# EasyEDA Pro project coBWeb.epro, board PCB1
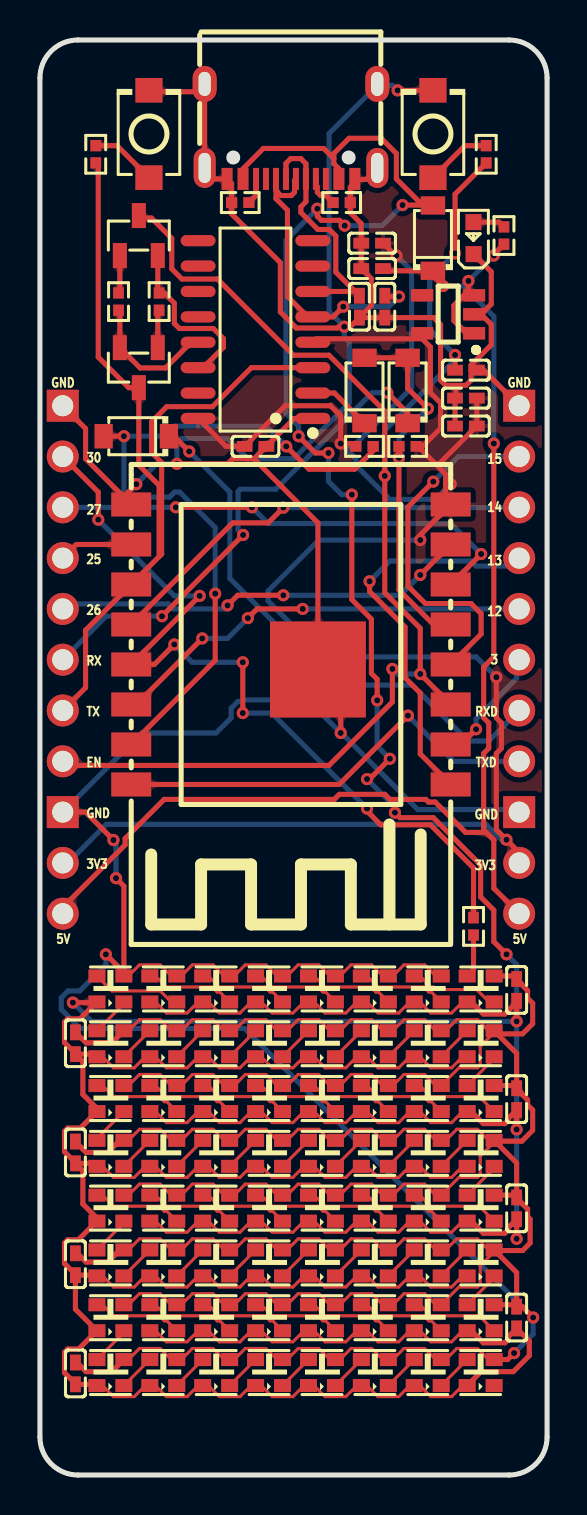
[diagram p2: board, top side]
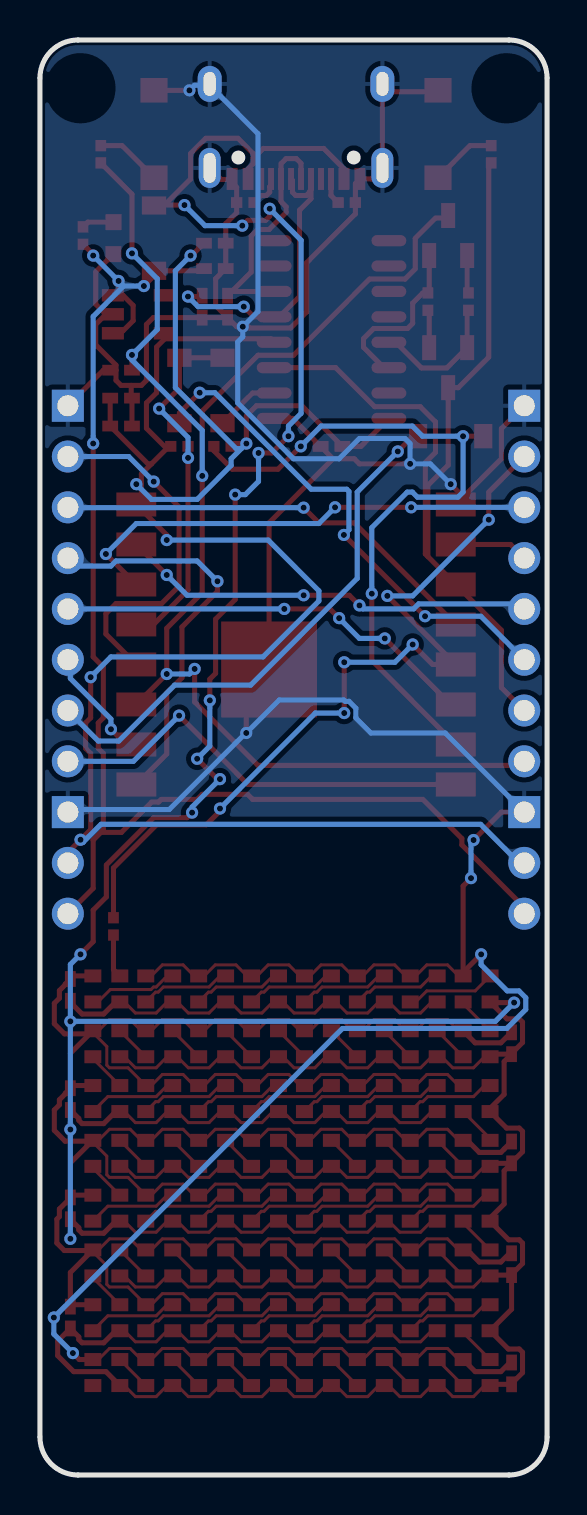
[diagram p3: board, bottom side, seen from below]

Outline 25.4 x 71.76 mm; copper layers: Top Layer, Bottom Layer. Coordinates in mm from the lower left corner of the outline.
Outline path: 0,69.85 0,1.91 arc(0.56,0.56) 1.91,0 23.5,0 arc(24.84,0.56) 25.4,1.91 25.4,69.85 arc(24.84,71.2) 23.5,71.76 1.91,71.76 arc(0.56,71.2) 0,69.85
Stack: Top Layer 0.035mm / Dielectric1 1.51mm FR4 er 4.5 / Bottom Layer 0.035mm

## Design rules (mm)
template: Custom Config
spacing copperThickness1oz (default): track to track 0.102, other pairs 0.152 to 0.3
spacing copperThickness2oz: track to track 0.203, other pairs 0.152 to 0.3
track width copperThickness1oz (default): min 0.127, default 0.254, max 2.54
track width copperThickness2oz: min 0.203, default 0.254, max 2.54
differential pair differentialPair (default): width min 0.127, default 0.254, max 2.54; gap min 0.152, default 0.152
via viaSize (default): diameter min 0.5, default 0.61, max 10; hole min 0.3, default 0.305, max 6.3

## Placement (name value [footprint] x y rotation side)
C1  100nF  [C0402]  16.64 60.33 180 top
C2  100nF  [C0402]  16.64 61.6 180 top
C3  100nF  [C0402]  17.27 58.42 270 top
C4  100nF  [C0402]  16 58.42 270 top
C5  100nF  [C0402]  21.34 52.45 180 top
C6  10uF  [C0402]  21.34 53.85 180 top
C7  100nF  [C0402]  10.79 51.44 180 top
C8  100nF  [C0402]  21.34 55.25 0 top
C9  100nF  [C0402]  23.88 24.26 270 top
C10  100nF  [C0402]  1.78 21.59 270 top
C11  100nF  [C0402]  1.78 5.08 270 top
C12  100nF  [C0402]  1.78 10.54 270 top
C13  100nF  [C0402]  23.88 7.87 270 top
C14  100nF  [C0402]  23.88 18.8 270 top
C15  100nF  [C0402]  1.78 16.13 270 top
C16  100nF  [C0402]  23.88 13.34 270 top
D1  1N5819HW-7-F  [SOD-123_L2.7-W1.6-LS3.7-RD]  19.69 61.85 90 top
D2  1N5819HW-7-F  [SOD-123_L2.7-W1.6-LS3.7-RD]  18.41 54.23 90 top
D3  1N5819HW-7-F  [SOD-123_L2.7-W1.6-LS3.7-RD]  16.26 54.23 90 top
D4  1N5819HW-7-F  [SOD-123_L2.7-W1.6-LS3.7-RD]  4.83 51.94 180 top
H1  HB-PH3-254111PB2GOP  [HDR-TH_11P-P2.54-V-M]  1.14 40.77 270 bottom
H2  HB-PH3-254111PB2GOP  [HDR-TH_11P-P2.54-V-M]  24 40.77 270 bottom
L1  2.4GHz  [WIFI-SMD_BW16]  12.57 41.53 180 top
LED1  XL-1608SURC-06  [LED0603-RD_RED]  21.72 61.85 90 top
LED2  XL-2020RGBC-WS2812B  [LED-SMD_4P-L2.0-W2.0-BR-1]  22.07 24.3 0 top
LED3  XL-2020RGBC-WS2812B  [LED-SMD_4P-L2.0-W2.0-BR-1]  19.42 24.3 0 top
LED4  XL-2020RGBC-WS2812B  [LED-SMD_4P-L2.0-W2.0-BR-1]  16.77 24.3 0 top
LED5  XL-2020RGBC-WS2812B  [LED-SMD_4P-L2.0-W2.0-BR-1]  14.13 24.3 0 top
LED6  XL-2020RGBC-WS2812B  [LED-SMD_4P-L2.0-W2.0-BR-1]  11.48 24.3 0 top
LED7  XL-2020RGBC-WS2812B  [LED-SMD_4P-L2.0-W2.0-BR-1]  8.83 24.3 0 top
LED8  XL-2020RGBC-WS2812B  [LED-SMD_4P-L2.0-W2.0-BR-1]  6.18 24.3 0 top
LED9  XL-2020RGBC-WS2812B  [LED-SMD_4P-L2.0-W2.0-BR-1]  3.53 24.3 0 top
LED10  XL-2020RGBC-WS2812B  [LED-SMD_4P-L2.0-W2.0-BR-1]  3.53 21.56 0 top
LED11  XL-2020RGBC-WS2812B  [LED-SMD_4P-L2.0-W2.0-BR-1]  6.18 21.56 0 top
LED12  XL-2020RGBC-WS2812B  [LED-SMD_4P-L2.0-W2.0-BR-1]  8.83 21.56 0 top
LED13  XL-2020RGBC-WS2812B  [LED-SMD_4P-L2.0-W2.0-BR-1]  11.48 21.56 0 top
LED14  XL-2020RGBC-WS2812B  [LED-SMD_4P-L2.0-W2.0-BR-1]  14.13 21.56 0 top
LED15  XL-2020RGBC-WS2812B  [LED-SMD_4P-L2.0-W2.0-BR-1]  16.77 21.56 0 top
LED16  XL-2020RGBC-WS2812B  [LED-SMD_4P-L2.0-W2.0-BR-1]  19.42 21.56 0 top
LED17  XL-2020RGBC-WS2812B  [LED-SMD_4P-L2.0-W2.0-BR-1]  22.07 21.56 0 top
LED18  XL-2020RGBC-WS2812B  [LED-SMD_4P-L2.0-W2.0-BR-1]  22.07 18.82 0 top
LED19  XL-2020RGBC-WS2812B  [LED-SMD_4P-L2.0-W2.0-BR-1]  19.42 18.82 0 top
LED20  XL-2020RGBC-WS2812B  [LED-SMD_4P-L2.0-W2.0-BR-1]  16.77 18.82 0 top
LED21  XL-2020RGBC-WS2812B  [LED-SMD_4P-L2.0-W2.0-BR-1]  14.13 18.82 0 top
LED22  XL-2020RGBC-WS2812B  [LED-SMD_4P-L2.0-W2.0-BR-1]  11.48 18.82 0 top
LED23  XL-2020RGBC-WS2812B  [LED-SMD_4P-L2.0-W2.0-BR-1]  8.83 18.82 0 top
LED24  XL-2020RGBC-WS2812B  [LED-SMD_4P-L2.0-W2.0-BR-1]  6.18 18.82 0 top
LED25  XL-2020RGBC-WS2812B  [LED-SMD_4P-L2.0-W2.0-BR-1]  3.53 18.82 0 top
LED26  XL-2020RGBC-WS2812B  [LED-SMD_4P-L2.0-W2.0-BR-1]  3.53 16.08 0 top
LED27  XL-2020RGBC-WS2812B  [LED-SMD_4P-L2.0-W2.0-BR-1]  6.18 16.08 0 top
LED28  XL-2020RGBC-WS2812B  [LED-SMD_4P-L2.0-W2.0-BR-1]  8.83 16.08 0 top
LED29  XL-2020RGBC-WS2812B  [LED-SMD_4P-L2.0-W2.0-BR-1]  11.48 16.08 0 top
LED30  XL-2020RGBC-WS2812B  [LED-SMD_4P-L2.0-W2.0-BR-1]  14.13 16.08 0 top
LED31  XL-2020RGBC-WS2812B  [LED-SMD_4P-L2.0-W2.0-BR-1]  16.77 16.08 0 top
LED32  XL-2020RGBC-WS2812B  [LED-SMD_4P-L2.0-W2.0-BR-1]  19.42 16.08 0 top
LED33  XL-2020RGBC-WS2812B  [LED-SMD_4P-L2.0-W2.0-BR-1]  22.07 16.08 0 top
LED34  XL-2020RGBC-WS2812B  [LED-SMD_4P-L2.0-W2.0-BR-1]  22.07 13.34 0 top
LED35  XL-2020RGBC-WS2812B  [LED-SMD_4P-L2.0-W2.0-BR-1]  19.42 13.34 0 top
LED36  XL-2020RGBC-WS2812B  [LED-SMD_4P-L2.0-W2.0-BR-1]  16.77 13.34 0 top
LED37  XL-2020RGBC-WS2812B  [LED-SMD_4P-L2.0-W2.0-BR-1]  14.13 13.34 0 top
LED38  XL-2020RGBC-WS2812B  [LED-SMD_4P-L2.0-W2.0-BR-1]  11.48 13.34 0 top
LED39  XL-2020RGBC-WS2812B  [LED-SMD_4P-L2.0-W2.0-BR-1]  8.83 13.34 0 top
LED40  XL-2020RGBC-WS2812B  [LED-SMD_4P-L2.0-W2.0-BR-1]  6.18 13.34 0 top
LED41  XL-2020RGBC-WS2812B  [LED-SMD_4P-L2.0-W2.0-BR-1]  3.53 13.34 0 top
LED42  XL-2020RGBC-WS2812B  [LED-SMD_4P-L2.0-W2.0-BR-1]  3.53 10.6 0 top
LED43  XL-2020RGBC-WS2812B  [LED-SMD_4P-L2.0-W2.0-BR-1]  6.18 10.6 0 top
LED44  XL-2020RGBC-WS2812B  [LED-SMD_4P-L2.0-W2.0-BR-1]  8.83 10.6 0 top
LED45  XL-2020RGBC-WS2812B  [LED-SMD_4P-L2.0-W2.0-BR-1]  11.48 10.6 0 top
LED46  XL-2020RGBC-WS2812B  [LED-SMD_4P-L2.0-W2.0-BR-1]  14.13 10.6 0 top
LED47  XL-2020RGBC-WS2812B  [LED-SMD_4P-L2.0-W2.0-BR-1]  16.77 10.6 0 top
LED48  XL-2020RGBC-WS2812B  [LED-SMD_4P-L2.0-W2.0-BR-1]  19.42 10.6 0 top
LED49  XL-2020RGBC-WS2812B  [LED-SMD_4P-L2.0-W2.0-BR-1]  22.07 10.6 0 top
LED50  XL-2020RGBC-WS2812B  [LED-SMD_4P-L2.0-W2.0-BR-1]  22.07 7.86 0 top
LED51  XL-2020RGBC-WS2812B  [LED-SMD_4P-L2.0-W2.0-BR-1]  19.42 7.86 0 top
LED52  XL-2020RGBC-WS2812B  [LED-SMD_4P-L2.0-W2.0-BR-1]  16.77 7.86 0 top
LED53  XL-2020RGBC-WS2812B  [LED-SMD_4P-L2.0-W2.0-BR-1]  14.13 7.86 0 top
LED54  XL-2020RGBC-WS2812B  [LED-SMD_4P-L2.0-W2.0-BR-1]  11.48 7.86 0 top
LED55  XL-2020RGBC-WS2812B  [LED-SMD_4P-L2.0-W2.0-BR-1]  8.83 7.86 0 top
LED56  XL-2020RGBC-WS2812B  [LED-SMD_4P-L2.0-W2.0-BR-1]  6.18 7.86 0 top
LED57  XL-2020RGBC-WS2812B  [LED-SMD_4P-L2.0-W2.0-BR-1]  3.53 7.86 0 top
LED58  XL-2020RGBC-WS2812B  [LED-SMD_4P-L2.0-W2.0-BR-1]  3.53 5.12 0 top
LED59  XL-2020RGBC-WS2812B  [LED-SMD_4P-L2.0-W2.0-BR-1]  6.18 5.12 0 top
LED60  XL-2020RGBC-WS2812B  [LED-SMD_4P-L2.0-W2.0-BR-1]  8.83 5.12 0 top
LED61  XL-2020RGBC-WS2812B  [LED-SMD_4P-L2.0-W2.0-BR-1]  11.48 5.12 0 top
LED62  XL-2020RGBC-WS2812B  [LED-SMD_4P-L2.0-W2.0-BR-1]  14.13 5.12 0 top
LED63  XL-2020RGBC-WS2812B  [LED-SMD_4P-L2.0-W2.0-BR-1]  16.77 5.12 0 top
LED64  XL-2020RGBC-WS2812B  [LED-SMD_4P-L2.0-W2.0-BR-1]  19.42 5.12 0 top
LED65  XL-2020RGBC-WS2812B  [LED-SMD_4P-L2.0-W2.0-BR-1]  22.07 5.12 0 top
Q1  S8050  [SOT-23-3_L2.9-W1.3-P1.90-LS2.4-BR]  4.95 55.37 90 top
Q2  S8050  [SOT-23-3_L2.9-W1.3-P1.90-LS2.4-BR]  4.95 61.98 270 top
R1  5.1kΩ  [R0402]  15.11 63.63 180 top
R2  5.1kΩ  [R0402]  10.03 63.63 0 top
R3  470Ω  [R0402]  23.24 61.98 90 top
R4  10kΩ  [R0402]  18.41 51.44 0 top
R5  10kΩ  [R0402]  16.26 51.44 0 top
R6  12kΩ  [R0402]  5.97 58.67 270 top
R7  12kΩ  [R0402]  3.94 58.67 90 top
R8  22Ω  [R0402]  22.35 66.04 90 top
R9  1kΩ  [R0402]  2.79 66.04 90 top
R10  470Ω  [R0402]  21.72 27.43 90 top
SW1  TS-1088-AR02016  [SW-SMD_L3.9-W3.0-P4.45]  19.69 67.06 90 top
SW2  TS-1088-AR02016  [SW-SMD_L3.9-W3.0-P4.45]  5.46 67.06 90 top
U1  AP2112K-3.3TRG1  [SOT-25-5_L2.9-W1.6-P0.95-LS2.8-BL]  20.45 58.04 90 top
U2  CH340C  [SOP-16_L10.0-W3.9-P1.27-LS6.0-BL]  10.79 57.28 90 top
USB1  TYPE-C 16PIN 2MD(073)  [USB-C-SMD_TYPE-C-6PIN-2MD-073]  12.57 67.18 180 top

## Footprints (pads in the part's own frame, mm; a bottom-side part is the same pattern mirrored in y, then rotated)
C0402
  rect 0.79x0.54 smd: 1(-0.545,0) 2(0.545,0)
HDR-TH_11P-P2.54-V-M
  rect 1.6x1.6 hole 1.05: 1(-12.7,0) 9(7.62,0)
  round 1.6 hole 1.05: 2(-10.16,0) 3(-7.62,0) 4(-5.08,0) 5(-2.54,0) 6(0,0) 7(2.54,0) 8(5.08,0) 10(10.16,0) 11(12.7,0)
LED0603-RD_RED
  rect 0.8x0.8 smd: 1(-0.799,-0.004) 2(0.799,0.004)
LED-SMD_4P-L2.0-W2.0-BR-1
  rect 0.85x0.65 smd: 1(0.675,-0.65) 2(0.675,0.65) 3(-0.675,0.65) 4(-0.675,-0.65)
R0402
  rect 0.566x0.54 smd: 1(-0.433,0) 2(0.433,0)
SOD-123_L2.7-W1.6-LS3.7-RD
  rect 0.91x1.22 smd: 1(-1.635,0) 2(1.635,0)
SOP-16_L10.0-W3.9-P1.27-LS6.0-BL
  oval 0.56x1.745 smd: 1(-4.445,-2.873) 2(-3.175,-2.873) 3(-1.905,-2.873) 4(-0.635,-2.873) 5(0.635,-2.873) 6(1.905,-2.873) 7(3.175,-2.873) 8(4.445,-2.873) 9(4.445,2.873) 10(3.175,2.873) 11(1.905,2.873) 12(0.635,2.873) 13(-0.635,2.873) 14(-1.905,2.873) 15(-3.175,2.873) 16(-4.445,2.873)
SOT-23-3_L2.9-W1.3-P1.90-LS2.4-BR
  rect 1.25x0.7 smd: 1(1,-0.95) 2(1,0.95) 3(-1,0)
SOT-25-5_L2.9-W1.6-P0.95-LS2.8-BL
  rect 0.623x1.105 smd: 1(-0.95,-1.3) 2(-0.001,-1.3) 3(0.95,-1.3) 4(0.95,1.3) 5(-0.95,1.3)
SW-SMD_L3.9-W3.0-P4.45
  rect 1.23x1.36 smd: 1(-2.185,0) 2(2.185,0)
USB-C-SMD_TYPE-C-6PIN-2MD-073
  rect 0.55x1.1 smd: 1(-3.2,2.375) 2(-2.4,2.375) 11(2.4,2.375) 12(3.2,2.375)
  rect 0.3x1.1 smd: 3(-1.75,2.375) 4(-1.25,2.375) 5(-0.75,2.375) 6(-0.25,2.375) 7(0.25,2.375) 8(0.75,2.375) 9(1.25,2.375) 10(1.75,2.375)
  oval 1.1x2 hole 0.6x1.5: 13(-4.325,1.825) 14(4.325,1.825)
  oval 1.2x1.8 hole 0.6x1.2: 13(-4.325,-2.375) 14(4.325,-2.375)
WIFI-SMD_BW16
  rect 2x1.2 smd: 1(-8,7) 2(-8,5) 3(-8,3) 4(-8,1) 5(-8,-1) 6(-8,-3) 7(-8,-5) 8(-8,-7) 9(8,-7) 10(8,-5) 11(8,-3) 12(8,-1) 13(8,1) 14(8,3) 15(8,5) 16(8,7)
  rect 4.8x4.8 smd: 17(-1.35,1.25)

## Nets
As in the schematic.

Pads without a net: LED65 1; U1 4; U2 7 8 9 10 11 12 15; USB1 3 9

## Via types
v1: diameter 0.61, hole 0.305, Top Layer to Bottom Layer, 71 vias

## Routing (per net, layer and track width the routed paths; a pad name or vN(x,y) marks a point on that pad's centre or on a via; arc(x,y) is an arc through that point)
3V3: length 108.9
  Top Layer w0.254: 19.05,51.32 20.06,52.34 20.06,53.61 19.56,54.12 19.56,56.4 19.15,56.81 ; 19.05,51.32 19.81,50.56 ; 19.05,51.32 18.94,51.44 R4.2 ; C2.1 17.8,60.98 v1(17.85,60.98) ; v1(19.05,46.75) 19.05,47.01 L1.8 20.32,48.78 20.32,49.55 ; 19.81,50.56 19.99,50.56 C5.1 C6.1 ; 19.81,50.56 20.32,50.05 20.32,49.55 ; 19.15,56.81 U1.5 ; 19.15,56.81 13.84,56.81 U2.4 ; R5.1 15.68,51.58 v1(15.06,51.58) 15.06,52.96 14.55,53.47 12.28,53.47 C7.2 9.32,51.44 7.92,52.83 ; 20.32,49.55 v1(20.57,49.55) ; v1(22.86,39.89) 22.86,37.86 23.11,37.61 23.11,36.34 22.86,36.08 22.86,32.27 v1(23.37,31.77) 24,31.13 H2.10
  Bottom Layer w0.254: v1(17.85,60.98) 18.62,60.21 18.62,54.37 15.57,51.32 15.31,51.32 ; 15.31,51.32 v1(15.06,51.58) ; 15.31,51.32 15.82,50.82 15.82,50.49 17.52,48.78 19.81,48.78 v1(20.57,49.55) ; v1(22.86,39.89) 21.84,40.91 14.22,40.91 11.43,43.7 11.43,44.21 13.97,46.75 v1(19.05,46.75) ; 23.37,31.64 23.24,31.64 22.34,32.54 3.33,32.54 1.27,30.48 1.14,30.48
5V: length 70.1
  Top Layer w0.254: v1(21.46,59.71) 21.46,59.27 U1.3 21.24,58.99 20.73,58.48 20.73,57.72 21.24,57.21 21.63,57.21 U1.1 ; R3.1 22.73,61.04 v1(22.73,60.98) ; 22.73,31.75 22.73,29.34 H2.11 ; 22.73,31.75 22.73,31.77 22.22,32.27 22.22,36.08 22.48,36.34 22.48,37.61 22.22,37.86 22.22,40.4 22.73,40.91 v1(22.73,51.58) ; 22.73,31.75 22.35,32.13 21.32,32.13 19.8,33.65 19.46,33.65 19.33,33.78 17.53,33.78 17.27,34.04 15,34.04 14.74,33.78 6.22,33.78 4.27,31.83 4.27,31.51 1.14,28.38 H1.11 ; v1(20.19,59.45) 19.69,59.96 D1.1 17.29,60.21 C1.1
  Bottom Layer w0.254: 21.21,59.45 22.73,57.93 v1(22.73,51.58) ; 21.21,59.45 v1(20.19,59.45) ; 21.21,59.45 v1(21.46,59.71) v1(22.73,60.98)
GND: length 408.3
  Top Layer w0.152: LED42.2 4.43,11.25 4.98,11.81 6.02,11.81 6.58,11.25 LED43.2 7.08,11.25 7.63,11.81 8.67,11.81 9.23,11.25 LED44.2 9.73,11.25 10.28,11.81 11.32,11.81 11.87,11.25 LED45.2 12.38,11.25 12.93,11.81 13.97,11.81 14.52,11.25 LED46.2 15.03,11.25 15.58,11.81 16.62,11.81 17.17,11.25 LED47.2 17.68,11.25 18.23,11.81 19.27,11.81 19.82,11.25 LED48.2 20.32,11.25 20.88,11.81 21.92,11.81 22.47,11.25 LED49.2 22.75,11.16 22.05,10.47 22.05,9.53 21.92,9.4 20.99,9.4 LED51.2 19.82,8.51 19.27,9.07 18.23,9.07 17.68,8.51 LED52.2 17.17,8.51 16.62,9.07 15.58,9.07 15.03,8.51 LED53.2 14.52,8.51 13.97,9.07 12.93,9.07 12.38,8.51 LED54.2 11.87,8.51 11.32,9.07 10.28,9.07 9.73,8.51 LED55.2 9.23,8.51 8.67,9.07 7.63,9.07 7.08,8.51 LED56.2 6.58,8.51 6.02,9.07 4.98,9.07 4.43,8.51 LED57.2 ; LED3.2 19.82,24.95 19.27,25.51 18.23,25.51 17.68,24.95 LED4.2 17.17,24.95 16.62,25.51 15.58,25.51 15.03,24.95 LED5.2 14.52,24.95 13.97,25.51 12.93,25.51 12.38,24.95 LED6.2 11.87,24.95 11.32,25.51 10.28,25.51 9.73,24.95 LED7.2 9.23,24.95 8.67,25.51 7.63,25.51 7.08,24.95 LED8.2 6.58,24.95 6.02,25.51 4.98,25.51 4.43,24.95 LED9.2 ; LED58.2 4.43,5.77 4.98,6.33 6.02,6.33 6.58,5.77 LED59.2 7.08,5.77 7.63,6.33 8.67,6.33 9.23,5.77 LED60.2 9.73,5.77 10.28,6.33 11.32,6.33 11.87,5.77 LED61.2 12.38,5.77 12.93,6.33 13.97,6.33 14.52,5.77 LED62.2 15.03,5.77 15.58,6.33 16.62,6.33 17.17,5.77 LED63.2 17.68,5.77 18.23,6.33 19.27,6.33 19.82,5.77 LED64.2 20.32,5.77 20.88,6.33 21.92,6.33 22.47,5.77 LED65.2 ; LED41.2 4.43,13.99 4.98,14.55 6.02,14.55 6.58,13.99 LED40.2 7.08,13.99 7.63,14.55 8.67,14.55 9.23,13.99 LED39.2 9.73,13.99 10.28,14.55 11.32,14.55 11.87,13.99 LED38.2 12.38,13.99 12.93,14.55 13.97,14.55 14.52,13.99 LED37.2 15.03,13.99 15.58,14.55 16.62,14.55 17.17,13.99 LED36.2 17.68,13.99 18.23,14.55 19.27,14.55 19.82,13.99 LED35.2 20.99,14.88 21.92,14.88 22.05,15.01 22.05,15.95 22.75,16.64 LED33.2 22.47,16.73 21.92,17.29 20.88,17.29 20.32,16.73 LED32.2 19.82,16.73 19.27,17.29 18.23,17.29 17.68,16.73 LED31.2 17.17,16.73 16.62,17.29 15.58,17.29 15.03,16.73 LED30.2 14.52,16.73 13.97,17.29 12.93,17.29 12.38,16.73 LED29.2 11.87,16.73 11.32,17.29 10.28,17.29 9.73,16.73 LED28.2 9.23,16.73 8.67,17.29 7.63,17.29 7.08,16.73 LED27.2 6.58,16.73 6.02,17.29 4.98,17.29 4.43,16.73 LED26.2 ; LED10.2 4.43,22.21 4.98,22.77 6.02,22.77 6.58,22.21 LED11.2 7.08,22.21 7.63,22.77 8.67,22.77 9.23,22.21 LED12.2 9.73,22.21 10.28,22.77 11.32,22.77 11.87,22.21 LED13.2 12.38,22.21 12.93,22.77 13.97,22.77 14.52,22.21 LED14.2 15.03,22.21 15.58,22.77 16.62,22.77 17.17,22.21 LED15.2 17.68,22.21 18.23,22.77 19.27,22.77 19.82,22.21 LED16.2 20.32,22.21 20.88,22.77 21.92,22.77 22.47,22.21 LED17.2 22.75,22.12 22.05,21.43 22.05,20.49 21.92,20.36 20.99,20.36 20.1,19.47 19.82,19.47 19.27,20.03 18.23,20.03 17.68,19.47 17.17,19.47 16.62,20.03 15.58,20.03 15.03,19.47 14.52,19.47 13.97,20.03 12.93,20.03 12.38,19.47 11.87,19.47 11.32,20.03 10.28,20.03 9.73,19.47 9.23,19.47 8.67,20.03 7.63,20.03 7.08,19.47 6.58,19.47 6.02,20.03 4.98,20.03 4.43,19.47 4.2,19.47
  Top Layer w0.254: 20.83,54.48 20.32,54.48 20.07,54.74 20.07,57.53 19.72,57.88 C3.2 C4.2 ; 20.83,54.48 20.83,53.89 C6.2 C5.2 ; 20.83,54.48 21.34,54.48 21.59,54.74 21.59,55.24 ; C16.1 23.76,13.99 LED34.2 ; C16.1 23.88,15.61 LED33.2 ; C16.1 24,13.75 24,13.72 24.42,13.3 24.42,12.92 24.55,12.79 24.55,11.6 24.18,11.23 22.78,11.23 ; 8.25,69.17 5.53,69.17 SW2.2 ; 8.25,69.17 USB1.14 8.8,64.81 USB1.12 9.6,64.58 R2.1 9.6,63.06 12.04,60.62 12.04,58.16 12.84,57.35 14.9,57.35 14.97,57.42 v1(15.24,57.42) 15.55,57.42 C4.2 ; 8.25,69.17 USB1.14 ; 22.9,22.06 24.17,22.06 24.68,22.57 24.68,23.59 24.42,23.84 24.42,24.22 24.13,24.52 24.13,24.55 C9.1 23.72,24.95 LED2.2 ; 22.9,22.06 23.88,21.09 C14.1 ; 22.9,22.06 LED17.2 ; H1.1 2.29,52.32 2.29,50.82 4.32,48.78 ; 21.59,55.24 C8.2 22.22,55.25 H2.1 ; 21.59,55.24 21.59,55.5 22.61,56.51 22.61,57.53 22.1,58.04 ; LED26.2 4.14,16.67 3.94,16.67 3.39,16.13 2.31,16.13 2.15,16.29 2.15,16.3 C15.1 ; LED50.2 23.78,8.51 C13.1 ; 22.75,19.47 23.74,19.47 C14.1 ; C14.1 24.13,19.09 24.13,19.06 24.42,18.76 24.42,18.51 24.68,18.25 24.68,17.23 24.14,16.69 22.79,16.69 ; 4.2,25.13 LED9.2 ; 4.2,25.13 4.2,29.45 v1(3.81,29.85) ; 4.2,25.13 v1(3.3,26.04) ; LED58.2 3.6,5.17 2.31,5.17 1.86,5.62 C11.1 ; 10.72,50.82 13.92,47.61 L1.17 15.07,39.14 v1(15.07,37.1) ; 10.72,50.82 9.65,50.82 9.4,50.56 v1(6.86,50.56) ; 10.72,50.82 12.74,52.83 13.67,52.83 ; v1(24.7,7.87) 24.16,8.42 C13.1 ; 22.1,58.04 U1.2 ; 22.1,58.04 22.61,58.55 22.61,60.16 LED1.1 ; C4.2 16.6,58.47 16.6,59.82 C1.2 C2.2 16.09,62.57 15.55,63.12 15.55,64.39 15.8,64.64 15.8,64.78 ; 22.78,11.23 LED49.2 ; 22.78,11.23 23.88,10.12 C13.1 ; LED10.2 3.6,21.61 2.31,21.61 1.79,22.14 C10.1 ; v1(3.68,31.75) 2.29,33.15 H1.9 ; LED65.2 23.43,5.77 v1(23.75,6.1) ; L1.9 4.32,48.78 ; 4.32,48.78 4.32,49.04 v1(4.83,49.55) ; 15.8,64.78 USB1.1 ; 15.8,64.78 16.32,64.78 USB1.13 ; v1(17.91,69.24) 19.68,69.24 ; LED42.2 4.04,11.09 3.83,11.09 3.39,10.65 2.31,10.65 1.88,11.09 C12.1
  Bottom Layer w0.254: H2.9 23.88,33.27 18.92,33.27 15.09,37.1 v1(15.07,37.1) 13.41,38.76 10.19,38.76 10.11,38.68 9.92,38.68 9.58,38.34 9.58,37.86 8.82,37.1 5.1,37.1 H1.9 ; v1(3.3,26.04) 3.3,25.51 1.99,24.21 1.41,24.21 1.07,23.86 1.07,23.28 2.02,22.33 10.25,22.33 v1(24.7,7.87) 24.7,7.05 v1(23.75,6.1) ; v1(4.83,49.55) 5.84,50.56 v1(6.86,50.56) 6.86,51.58 7.11,51.83 9.4,51.83 10.41,50.82 12.7,50.82 15.5,53.61 15.5,56.66 15.24,56.91 v1(15.24,57.42) 14.48,58.18 14.48,67.07 16.9,69.49 ; 16.9,69.49 USB1.13 ; 16.9,69.49 17.66,69.49 v1(17.91,69.24) ; v1(3.81,29.85) 3.81,31.62 v1(3.68,31.75)
VBUS: length 316.7
  Top Layer w0.152: 21.4,20.91 21.17,20.91 20.62,20.36 19.58,20.36 19.03,20.91 18.52,20.91 17.97,20.36 16.93,20.36 16.38,20.91 15.87,20.91 15.32,20.36 14.28,20.36 13.73,20.91 13.22,20.91 12.67,20.36 11.63,20.36 11.08,20.91 10.58,20.91 10.02,20.36 8.98,20.36 8.43,20.91 7.93,20.91 7.37,20.36 6.33,20.36 5.78,20.91 5.28,20.91 4.72,20.36 3.69,20.36 3.13,20.91 2.85,20.91 ; LED40.4 5.78,12.69 6.33,12.14 7.37,12.14 7.93,12.69 LED39.4 8.43,12.69 8.98,12.14 10.02,12.14 10.58,12.69 LED38.4 11.08,12.69 11.63,12.14 12.67,12.14 13.22,12.69 LED37.4 13.73,12.69 14.28,12.14 15.32,12.14 15.87,12.69 LED36.4 16.38,12.69 16.93,12.14 17.97,12.14 18.52,12.69 LED35.4 19.03,12.69 19.58,12.14 20.62,12.14 21.17,12.69 LED34.4 ; 21.4,18.17 21.17,18.17 20.62,17.62 19.58,17.62 19.03,18.17 18.52,18.17 17.97,17.62 16.93,17.62 16.38,18.17 15.87,18.17 15.32,17.62 14.28,17.62 13.73,18.17 13.22,18.17 12.67,17.62 11.63,17.62 11.08,18.17 10.58,18.17 10.02,17.62 8.98,17.62 8.43,18.17 7.93,18.17 7.37,17.62 6.33,17.62 5.78,18.17 5.5,18.17 ; LED26.4 3.13,15.43 3.69,14.88 4.72,14.88 5.28,15.43 LED27.4 5.78,15.43 6.33,14.88 7.37,14.88 7.93,15.43 LED28.4 8.43,15.43 8.98,14.88 10.02,14.88 10.58,15.43 LED29.4 11.08,15.43 11.63,14.88 12.67,14.88 13.22,15.43 LED30.4 13.73,15.43 14.28,14.88 15.32,14.88 15.87,15.43 LED31.4 16.38,15.43 16.93,14.88 17.97,14.88 18.52,15.43 LED32.4 19.03,15.43 19.58,14.88 20.62,14.88 21.17,15.43 LED33.4 ; LED58.4 3.13,4.47 3.69,3.92 4.72,3.92 5.28,4.47 LED59.4 5.78,4.47 6.33,3.92 7.37,3.92 7.93,4.47 LED60.4 8.43,4.47 8.98,3.92 10.02,3.92 10.58,4.47 LED61.4 11.08,4.47 11.63,3.92 12.67,3.92 13.22,4.47 LED62.4 13.73,4.47 14.28,3.92 15.32,3.92 15.87,4.47 LED63.4 16.38,4.47 16.93,3.92 17.97,3.92 18.52,4.47 LED64.4 19.03,4.47 19.58,3.92 20.62,3.92 21.17,4.47 LED65.4 ; LED50.4 21.17,7.21 20.62,6.66 19.58,6.66 19.03,7.21 LED51.4 18.52,7.21 17.97,6.66 16.93,6.66 16.38,7.21 LED52.4 15.87,7.21 15.32,6.66 14.28,6.66 13.73,7.21 LED53.4 13.22,7.21 12.67,6.66 11.63,6.66 11.08,7.21 LED54.4 10.58,7.21 10.02,6.66 8.98,6.66 8.43,7.21 LED55.4 7.93,7.21 7.37,6.66 6.33,6.66 5.78,7.21 LED56.4 ; LED42.4 3.13,9.95 3.69,9.4 4.72,9.4 5.28,9.95 LED43.4 5.78,9.95 6.33,9.4 7.37,9.4 7.93,9.95 LED44.4 8.43,9.95 8.98,9.4 10.02,9.4 10.58,9.95 LED45.4 11.08,9.95 11.63,9.4 12.67,9.4 13.22,9.95 LED46.4 13.73,9.95 14.28,9.4 15.32,9.4 15.87,9.95 LED47.4 16.38,9.95 16.93,9.4 17.97,9.4 18.52,9.95 LED48.4 19.03,9.95 19.58,9.4 20.62,9.4 21.17,9.95 LED49.4 ; LED8.4 5.78,23.65 6.33,23.1 7.37,23.1 7.93,23.65 LED7.4 8.43,23.65 8.98,23.1 10.02,23.1 10.58,23.65 LED6.4 11.08,23.65 11.63,23.1 12.67,23.1 13.22,23.65 LED5.4 13.73,23.65 14.28,23.1 15.32,23.1 15.87,23.65 LED4.4 16.38,23.65 16.93,23.1 17.97,23.1 18.52,23.65 LED3.4 19.03,23.65 19.58,23.1 20.62,23.1 21.17,23.65 LED2.4
  Top Layer w0.254: C15.2 2.7,15.58 LED26.4 ; C15.2 2.15,15.21 2.15,13.55 2.85,12.85 LED41.4 1.92,11.76 1.39,11.76 1.23,11.6 1.23,10.58 1.78,10.03 1.78,10 ; C15.2 1.78,15.61 1.23,16.16 1.23,17.18 1.39,17.35 2.03,17.35 2.85,18.17 2.85,18.33 2.15,19.03 2.15,20.67 C10.2 ; v1(17.78,33.12) 18.03,32.87 19.71,32.87 22.07,30.5 22.07,28.9 22.73,28.24 22.73,26.67 v1(23.37,26.04) ; 14.72,65.82 14.21,66.33 11.19,66.33 10.17,65.32 USB1.11 ; 14.72,65.82 14.72,66.08 15.48,66.84 17.09,66.84 17.85,66.08 17.85,64.81 19.16,63.5 ; 14.72,65.82 14.72,65.57 14.97,65.32 USB1.2 ; v1(23.88,17.28) C14.2 23.45,17.83 23.45,17.73 23.29,17.57 22.21,17.57 21.6,18.17 21.4,18.17 ; 1.78,10 1.78,8.29 LED57.4 1.94,6.3 1.39,6.3 1.23,6.14 1.23,5.11 1.78,4.57 C11.2 2.79,4.54 LED58.4 ; 1.78,10 2.81,10 LED42.4 ; LED65.4 22.09,5.17 23.71,5.17 24.51,5.97 24.51,6.69 C13.2 23.45,6.9 23.45,6.77 23.29,6.61 22.21,6.61 21.6,7.21 LED50.4 ; LED2.4 21.6,23.65 22.21,23.05 23.29,23.05 23.88,23.64 ; 2.85,20.91 2.72,21.05 C10.2 ; 2.82,23.62 LED9.4 ; 2.82,23.62 v1(1.65,23.62) ; 2.82,23.62 2.01,22.81 1.39,22.81 1.23,22.65 1.23,21.62 1.78,21.08 C10.2 ; v1(16.38,34.8) 16.51,34.8 v1(17.53,35.81) ; C9.2 v1(23.88,22.68) ; v1(23.88,11.81) C16.2 23.45,12.37 23.45,12.25 23.29,12.09 22.21,12.09 21.6,12.69 LED34.4 ; v1(13.89,63.32) 13.89,62.94 14.1,62.74 15,62.74 v1(15.26,62.47) ; v1(14.45,51.11) 13.79,51.11 v1(12.95,51.94) ; 19.16,63.5 19.18,63.48 19.69,63.48 19.67,63.5 19.16,63.5 ; 19.16,63.5 v1(18.16,63.5) ; v1(15.62,49.02) 15.62,43.78 16.6,42.79 16.6,40.08 16.89,39.8 v1(16.89,38.74)
  Bottom Layer w0.254: v1(1.65,23.62) 2.59,22.68 v1(23.88,22.68) ; v1(16.89,38.74) 16.89,36.45 v1(17.53,35.81) ; v1(14.45,51.11) 14.45,49.68 15.11,49.02 v1(15.62,49.02) ; v1(16.38,34.8) 17.78,33.4 v1(17.78,33.12) ; v1(18.16,63.5) 17.13,62.47 v1(15.26,62.47) ; v1(23.37,26.04) 23.88,25.53 v1(23.88,22.68) ; v1(23.88,11.81) v1(23.88,17.28) v1(23.88,22.68) ; v1(12.95,51.94) 12.95,52.45 12.32,53.09 12.32,61.74 v1(13.89,63.32)
CH340_TXD: length 3.2
  Top Layer w0.254: D3.1 14.75,54.1 U2.2
CHIP_EN: length 73.9
  Top Layer w0.254: Q2.3 5.08,62.85 5.59,62.85 6.6,61.83 6.6,60.31 7.11,59.8 8.89,59.8 12.7,55.99 14.48,55.99 17.27,53.2 v1(17.27,49.96) 17.27,44.12 19.05,42.34 v1(19.05,40.05) L1.3 ; R8.1 20.79,64.05 v1(20.79,61.09) ; v1(17.65,40.31) 17.65,38.66 14.48,35.48 1.35,35.48 H1.8 ; v1(20.79,56.01) C8.1
  Bottom Layer w0.254: v1(17.65,40.31) 17.91,40.05 v1(19.05,40.05) ; v1(20.79,61.09) 19.52,59.82 19.52,57.28 v1(20.79,56.01) 20.79,55.75 17.27,52.23 v1(17.27,49.96)
D+: length 15.1
  Top Layer w0.254: v1(17.99,58.93) 17.31,58.93 C3.1 ; v1(15.19,58.42) 14.68,57.91 U2.5 13.41,57.91 12.4,58.93 12.4,63.25 11.82,63.82 11.82,64.24 ; USB1.8 11.82,64.24 ; 11.82,64.24 11.89,64.17 11.89,64.14 12.06,63.98 12.59,63.98 12.75,64.14 12.75,64.74 USB1.6
  Bottom Layer w0.254: v1(17.99,58.93) 17.48,58.42 v1(15.19,58.42)
D-: length 12.4
  Top Layer w0.254: 15.78,59.18 C4.1 ; 15.78,59.18 14.82,60.15 14.82,61.95 14.49,62.28 13.92,62.28 13.07,63.13 13.07,63.42 13.32,63.67 USB1.5 13.32,65.57 13.07,65.82 12.56,65.82 12.32,65.59 USB1.7 ; 15.78,59.18 U2.6
DTR: length 6.8
  Top Layer w0.254: U2.13 7.57,56.64 6.29,55.36 5.02,55.36 Q1.2 4,58.18 R7.1
LED_DAT: length 2.2
  Top Layer w0.254: LED2.3 21.72,25.27 R10.1
PA7_TX: length 47.2
  Top Layer w0.254: 5.97,45.93 L1.11 2.29,42.24 2.29,39.37 H1.7 ; 5.97,45.93 5.97,49.48 4.95,50.5 Q1.3 4.44,54.37 2.92,55.9 2.92,65.48 R9.1 ; 5.97,45.93 6.1,46.05 6.1,50.63 5.59,51.13 5.59,52.66 6.35,53.42 8.64,53.42 10.59,55.37 U2.3
PA8_LOG_RX: length 25.4
  Top Layer w0.254: v1(10.18,47.01) v1(6.11,42.94) ; v1(17.4,54.12) 18.41,53.1 D2.1
  Bottom Layer w0.254: H1.6 3.32,42.94 v1(6.11,42.94) ; v1(10.18,47.01) 9.92,47.26 9.92,49.18 10.03,49.29 11.81,49.29 16.64,54.12 v1(17.4,54.12)
PA8_RX: length 18.7
  Top Layer w0.254: R4.1 v1(17.98,50.86) 17.98,44.26 19.71,42.53 L1.5 ; D3.2 D2.2 18.41,54.34 v1(19.43,53.32)
  Bottom Layer w0.254: v1(17.98,50.86) 17.98,51.88 v1(19.43,53.32)
PA12: length 21.4
  Top Layer w0.254: v1(8.13,41.83) 4.83,38.53 L1.14 ; v1(10.41,42.85) 10.88,43.31 v1(13.16,43.31)
  Bottom Layer w0.254: v1(13.16,43.31) H2.5 ; v1(10.41,42.85) 9.4,41.83 v1(8.13,41.83)
PA13: length 20
  Top Layer w0.254: v1(16.51,44.69) 16.51,44.18 18.29,42.4 18.29,39.86 19.05,39.1 19.05,36.05 L1.1
  Bottom Layer w0.254: v1(16.51,44.69) 17.52,45.71 21.59,45.71 21.84,45.45 23.61,45.45 H2.4
PA14: length 21.9
  Top Layer w0.254: L1.12 9.65,47.61 11.43,47.61 v1(12.19,48.37)
  Bottom Layer w0.254: H2.3 23.99,48.37 v1(12.19,48.37)
PA15: length 18
  Top Layer w0.254: L1.4 22.1,42.05 22.1,43.07 21.59,43.58 19.3,43.58 18.43,44.45 18.43,48.4 v1(19.7,49.67)
  Bottom Layer w0.254: H2.2 20.95,50.93 v1(19.7,49.67)
PA25: length 3.7
  Top Layer w0.254: H1.4 1.82,46.53 L1.10
PA26: length 21
  Top Layer w0.254: v1(12.19,43.99) 9.91,43.99 v1(9.4,43.48) ; L1.7 v1(19.05,45.01)
  Bottom Layer w0.254: v1(12.19,43.99) 18.03,43.99 v1(19.05,45.01) ; v1(9.4,43.48) 9.22,43.31 6.68,43.31 6.43,43.56 1.4,43.56 H1.5
PA27: length 24.1
  Top Layer w0.254: v1(10.62,48.39) v1(6.81,48.39) ; L1.6 v1(22.1,46.05)
  Bottom Layer w0.254: v1(6.81,48.39) H1.3 ; v1(10.62,48.39) 11.43,47.58 20.57,47.58 v1(22.1,46.05)
PA30: length 41.6
  Top Layer w0.254: v1(10.16,38.1) v1(10.16,40.64) ; v1(2.92,47.77) 2.92,49.15 H1.2 ; v1(6.73,41.53) 5.73,40.53 L1.13 ; 21.72,27.74 21.72,30.35 19.56,32.51 17.07,32.51 16.38,33.2 ; 4.57,40.53 v1(8,43.96)
  Bottom Layer w0.254: v1(2.92,47.77) 6.73,43.96 v1(8,43.96) ; v1(10.16,40.64) 7.62,40.64 v1(6.73,41.53) ; v1(16.38,33.33) 11.61,38.1 v1(10.16,38.1)
PB1_TXD: length 21.8
  Top Layer w0.254: v1(18.43,37.97) 14.99,34.53 L1.16
  Bottom Layer w0.254: H2.8 20.72,35.69 v1(18.43,37.97)
PB2_RXD: length 36.2
  Top Layer w0.254: D4.2 v1(4.21,51.94) ; L1.15 8.78,40.74 v1(8.78,44.07) ; R5.2 16.69,51.22 15.76,50.29 13.48,50.29 v1(12.33,51.44)
  Bottom Layer w0.254: v1(8.78,44.07) 8.78,47.37 7,49.15 6.75,49.15 6.49,48.9 4.46,48.9 4.21,49.15 4.21,51.69 4.46,51.94 ; v1(4.21,51.94) 4.46,51.94 ; 4.46,51.94 6.24,51.94 6.75,52.45 11.32,52.45 v1(12.33,51.44)
PB3: length 6
  Top Layer w0.254: L1.2 21.08,36.53 v1(21.84,37.29)
  Bottom Layer w0.254: H2.6 23.88,40.64 23.88,39.83 21.84,37.8 v1(21.84,37.29)
RTS: length 8.8
  Top Layer w0.254: U2.14 8.18,55.37 9.19,56.39 9.19,56.82 8.68,57.33 6.98,57.33 6.73,57.58 6.73,58.6 6.22,59.11 R6.1 5.9,59.17 Q2.2
RXD: length 27
  Top Layer w0.254: v1(7.48,51.18) 6.72,51.94 D4.1
  Bottom Layer w0.254: H2.7 22.48,36.7 21.45,36.7 18.65,39.5 14.84,39.5 9.51,44.83 9.51,49.15 v1(7.48,51.18)
$1N319: length 1.7
  Top Layer w0.254: USB1.4 13.82,64.48 13.89,64.41 13.89,64.14 14.06,63.98 14.33,63.98 R1.2
$1N345: length 1.3
  Top Layer w0.254: R2.2 10.82,63.98 USB1.10
$1N1416: length 1.6
  Top Layer w0.254: LED1.2 23,62.65 R3.2
$1N3534: length 1.9
  Top Layer w0.254: R6.2 5.9,58.18 Q1.1
$1N3690: length 1.9
  Top Layer w0.254: Q2.1 4,59.17 R7.2
$1N4083: length 3.3
  Top Layer w0.254: R9.2 3.86,66.47 SW2.1
$1N4093: length 3.3
  Top Layer w0.254: SW1.1 21.29,66.47 R8.2
$2N39191: length 4.5
  Top Layer w0.152: LED3.3 18.88,24.83 19.15,24.83 19.58,24.4 19.71,24.4 19.84,24.27 21.87,24.27 22.49,23.65 LED2.1
$2N39277: length 4.5
  Top Layer w0.152: LED4.1 16.96,24.15 16.82,24.15 16.57,24.4 14.28,24.4 13.73,24.95 LED5.3
$2N39445: length 4.5
  Top Layer w0.152: LED6.1 11.66,24.15 11.53,24.15 11.27,24.4 8.98,24.4 8.43,24.95 LED7.3
$2N39449: length 4.5
  Top Layer w0.152: LED8.1 6.58,23.65 6.02,24.21 3.6,24.21 LED9.3
$2N39455: length 4.5
  Top Layer w0.152: LED4.3 16.38,24.95 16.93,24.4 19.22,24.4 19.47,24.15 19.61,24.15 LED3.1
$2N39461: length 4.5
  Top Layer w0.152: LED6.3 11.08,24.95 11.63,24.4 13.92,24.4 14.18,24.15 14.31,24.15 LED5.1
$2N39468: length 4.5
  Top Layer w0.152: LED7.1 9.01,24.15 8.88,24.15 8.62,24.4 6.33,24.4 5.78,24.95 LED8.3
$2N39874: length 2
  Top Layer w0.152: LED9.1 4.2,23.56 LED10.3
$2N39921: length 1.8
  Top Layer w0.152: 4.2,20.91 5.5,22.21
$2N40007: length 1.8
  Top Layer w0.152: 9.5,20.91 10.8,22.21
$2N40013: length 1.8
  Top Layer w0.152: 6.85,20.91 8.15,22.21
$2N40184: length 1.8
  Top Layer w0.152: 14.8,20.91 16.1,22.21
$2N40188: length 1.8
  Top Layer w0.152: 20.1,20.92 LED17.3
$2N40194: length 1.8
  Top Layer w0.152: 17.45,20.91 18.75,22.21
$2N40200: length 1.8
  Top Layer w0.152: 12.15,20.91 13.45,22.21
$2N40861: length 4.5
  Top Layer w0.152: 18.75,19.47 19.03,19.47 19.58,18.92 22,18.92 22.75,18.17
$2N40865: length 4.5
  Top Layer w0.152: 17.45,18.17 16.96,18.67 16.82,18.67 16.57,18.92 14.28,18.92 13.73,19.47 13.45,19.47
$2N40869: length 4.5
  Top Layer w0.152: 12.15,18.17 11.66,18.67 11.53,18.67 11.27,18.92 8.98,18.92 8.43,19.47 8.15,19.47
$2N40873: length 4.5
  Top Layer w0.152: 2.85,19.47 3.13,19.47 3.69,18.92 5.97,18.92 6.23,18.67 6.36,18.67 6.85,18.17
$2N40877: length 4.5
  Top Layer w0.152: 20.1,18.17 19.61,18.67 19.47,18.67 19.22,18.92 16.93,18.92 16.38,19.47 16.1,19.47
$2N40881: length 4.5
  Top Layer w0.152: 14.8,18.17 14.31,18.67 14.18,18.67 13.92,18.92 11.63,18.92 11.08,19.47 10.8,19.47
$2N40885: length 4.5
  Top Layer w0.152: 9.5,18.17 9.01,18.67 8.88,18.67 8.62,18.92 6.33,18.92 5.78,19.47 5.5,19.47
$2N40889: length 2
  Top Layer w0.152: 4.2,18.17 2.85,16.82 LED26.3
$2N40893: length 1.8
  Top Layer w0.152: LED26.1 LED27.3
$2N40897: length 1.8
  Top Layer w0.152: LED28.1 LED29.3
$2N40901: length 1.8
  Top Layer w0.152: LED27.1 LED28.3
$2N40905: length 1.8
  Top Layer w0.152: LED30.1 LED31.3
$2N40909: length 1.8
  Top Layer w0.152: LED32.1 LED33.3
$2N40913: length 1.8
  Top Layer w0.152: LED31.1 LED32.3
$2N40917: length 1.8
  Top Layer w0.152: LED29.1 LED30.3
$2N40927: length 2
  Top Layer w0.152: 22.75,20.91 22.75,20.82 21.4,19.47
$2N42244: length 1.8
  Top Layer w0.152: LED42.1 LED43.3
$2N42248: length 1.8
  Top Layer w0.152: LED44.1 LED45.3
$2N42252: length 1.8
  Top Layer w0.152: LED43.1 LED44.3
$2N42256: length 2
  Top Layer w0.152: LED58.3 4.2,7.12 LED57.1
$2N42260: length 1.8
  Top Layer w0.152: LED58.1 5.5,5.77
$2N42264: length 1.8
  Top Layer w0.152: LED61.1 13.45,5.77
$2N42268: length 1.8
  Top Layer w0.152: LED59.1 8.15,5.77
$2N42272: length 1.8
  Top Layer w0.152: LED60.1 10.8,5.77
$2N42276: length 1.8
  Top Layer w0.152: LED62.1 16.1,5.77
$2N42280: length 4.5
  Top Layer w0.152: LED54.3 11.08,8.51 11.63,7.96 13.92,7.96 14.18,7.71 14.31,7.71 LED53.1
$2N42284: length 4.5
  Top Layer w0.152: LED57.3 3.13,8.51 3.69,7.96 5.97,7.96 6.23,7.71 6.36,7.71 LED56.1
$2N42288: length 4.5
  Top Layer w0.152: LED55.1 9.01,7.71 8.88,7.71 8.62,7.96 6.33,7.96 5.78,8.51 LED56.3
$2N42292: length 4.5
  Top Layer w0.152: LED52.1 16.96,7.71 16.82,7.71 16.57,7.96 14.28,7.96 13.73,8.51 LED53.3
$2N42296: length 4.5
  Top Layer w0.152: LED55.3 8.43,8.51 8.98,7.96 11.27,7.96 11.53,7.71 11.66,7.71 LED54.1
$2N42300: length 4.5
  Top Layer w0.152: LED39.1 9.01,13.19 8.88,13.19 8.62,13.44 6.33,13.44 5.78,13.99 LED40.3
$2N42304: length 4.5
  Top Layer w0.152: LED39.3 8.43,13.99 8.98,13.44 11.27,13.44 11.53,13.19 11.66,13.19 LED38.1
$2N42308: length 4.5
  Top Layer w0.152: LED38.3 11.08,13.99 11.63,13.44 13.92,13.44 14.18,13.19 14.31,13.19 LED37.1
$2N42312: length 1.8
  Top Layer w0.152: LED48.1 LED49.3
$2N42316: length 4.5
  Top Layer w0.152: LED50.1 22,7.96 19.58,7.96 19.03,8.51 LED51.3
$2N42320: length 1.8
  Top Layer w0.152: LED64.1 21.4,5.77
$2N42324: length 4.5
  Top Layer w0.152: LED37.3 13.73,13.99 14.28,13.44 16.57,13.44 16.82,13.19 16.96,13.19 LED36.1
$2N42328: length 4.5
  Top Layer w0.152: LED36.3 16.38,13.99 16.93,13.44 19.22,13.44 19.47,13.19 19.61,13.19 LED35.1
$2N42332: length 4.5
  Top Layer w0.152: LED34.1 22,13.44 19.58,13.44 19.03,13.99 LED35.3
$2N42336: length 1.8
  Top Layer w0.152: LED45.1 LED46.3
$2N42340: length 1.8
  Top Layer w0.152: LED46.1 LED47.3
$2N42344: length 4.5
  Top Layer w0.152: LED52.3 16.38,8.51 16.93,7.96 19.22,7.96 19.47,7.71 19.61,7.71 LED51.1
$2N42348: length 1.8
  Top Layer w0.152: LED63.1 18.75,5.77
$2N42352: length 1.8
  Top Layer w0.152: LED47.1 LED48.3
$2N42356: length 4.5
  Top Layer w0.152: LED40.1 6.36,13.19 6.23,13.19 5.97,13.44 3.69,13.44 3.13,13.99 LED41.3
$2N42360: length 2
  Top Layer w0.152: LED41.1 4.2,12.6 LED42.3
$2N42364: length 2
  Top Layer w0.152: LED50.3 22.75,9.86 LED49.1
$2N42370: length 2
  Top Layer w0.152: LED33.1 22.75,15.34 LED34.3

## Copper pours and planes (outline as drawn; the poured copper is in the pictures)
3V3 on Top Layer: -1.14,72.64 28.45,72.64 28.45,33.53 -1.14,33.53
GND on Bottom Layer: -1.52,73.03 29.21,73.03 29.21,32.39 -1.52,32.39

Small or netless copper shapes (teardrops, artwork), in the pictures only: 188 on Top Layer, 87 on Bottom Layer

## Text on the board
Top Silkscreen Layer: GND | 5V | RX | 30 | 25 | 26 | TX | EN | 3V3 | 27 | RXD | TXD | 3 | 15 | 14 | 13 | 12
